# EAGLE design IOIO-v12 (EAGLE 5.11)
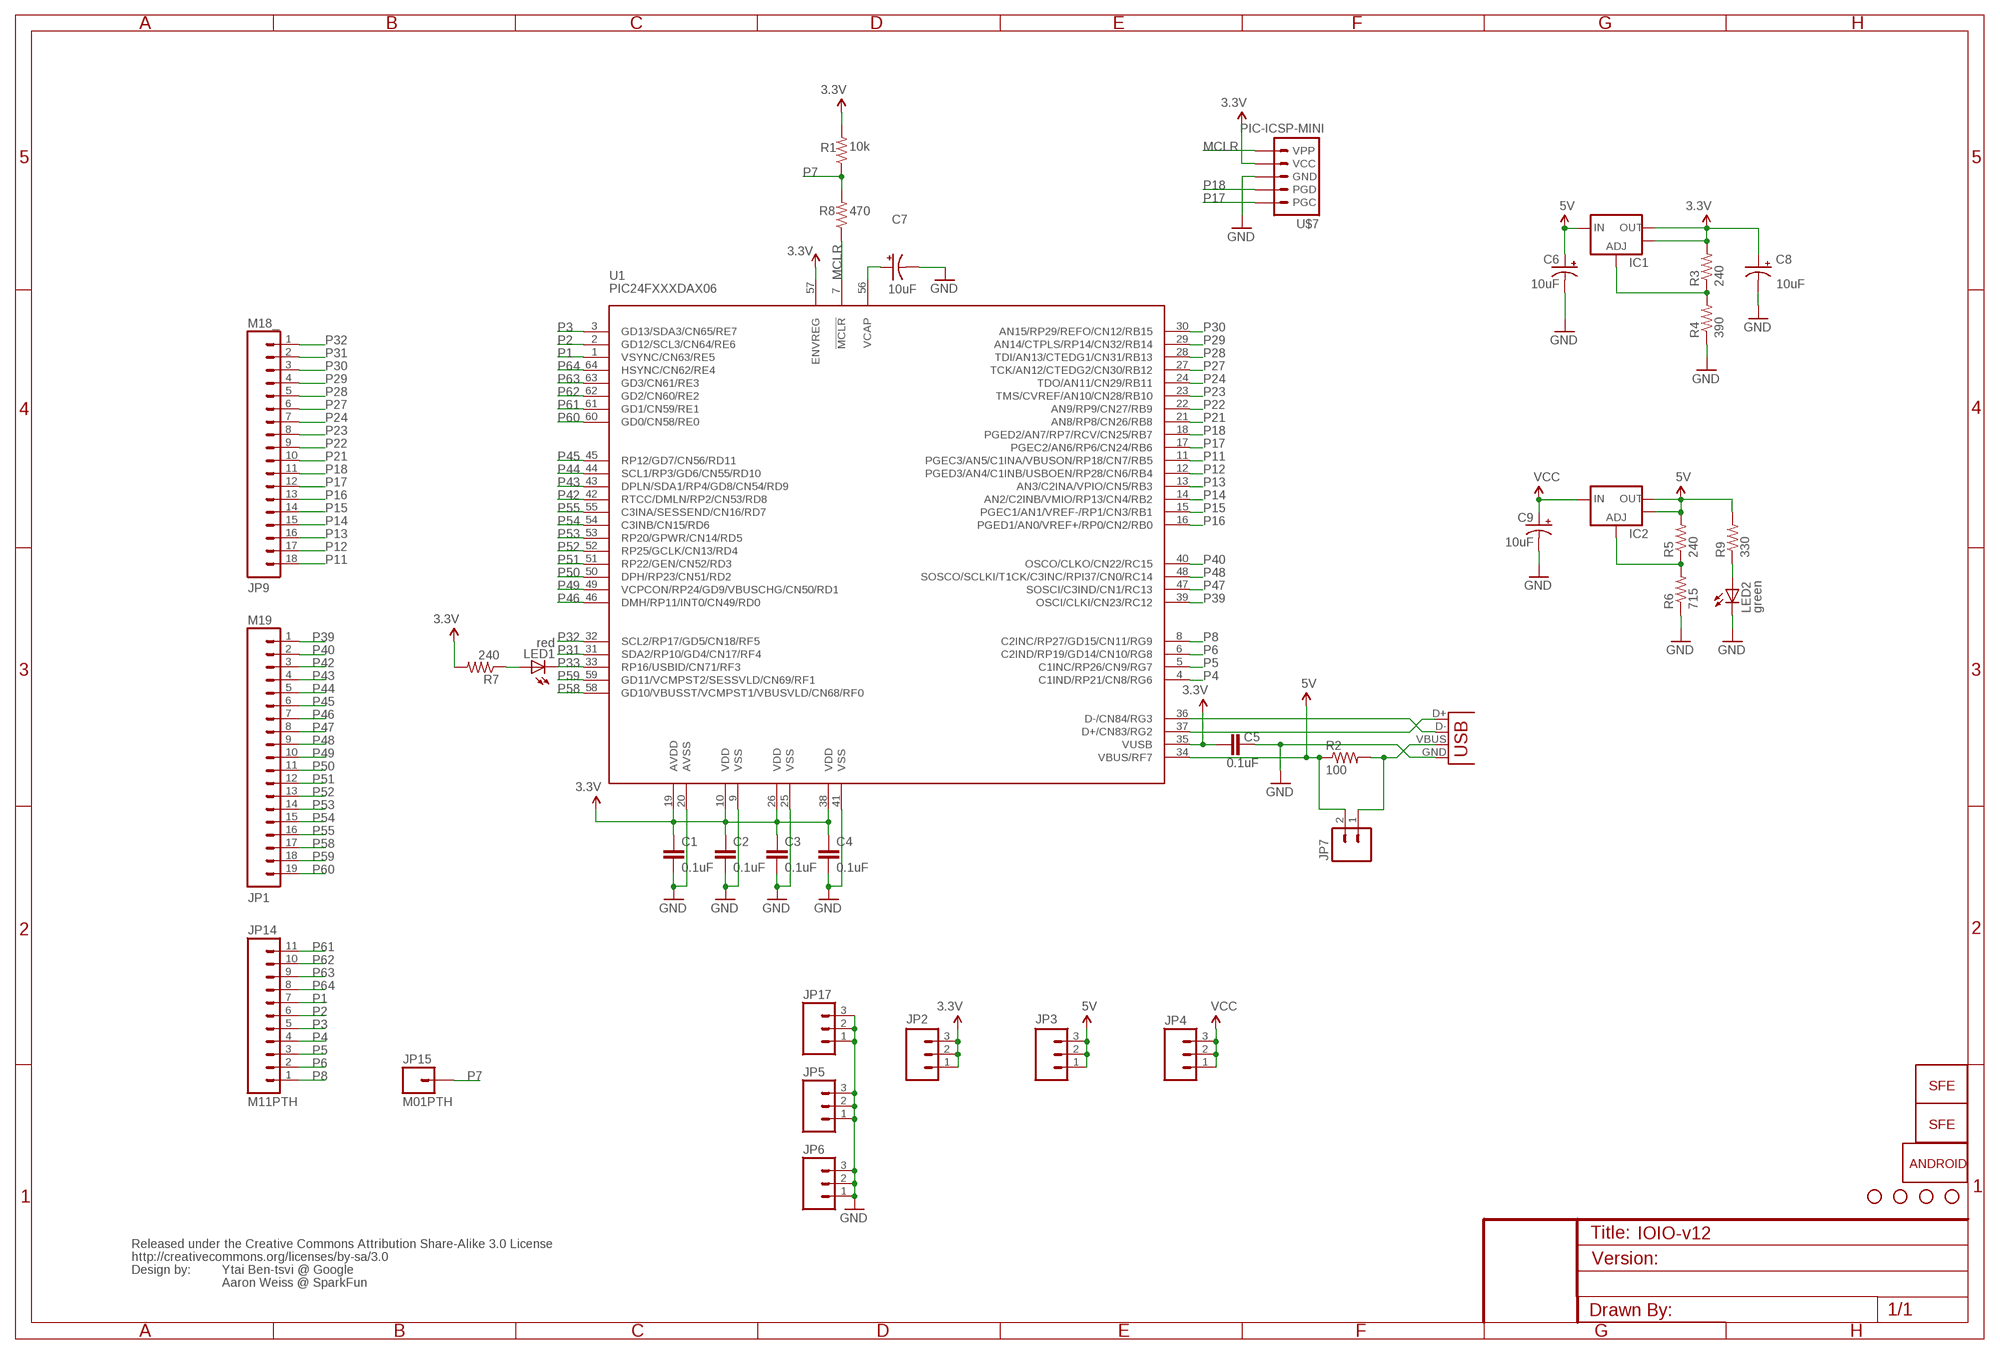
[diagram p0: schematic, sheet 1]

## Parts
C1  0.1uF  CAP0402-CAP  [0402-CAP]
C2  0.1uF  CAP0402-CAP  [0402-CAP]
C3  0.1uF  CAP0402-CAP  [0402-CAP]
C4  0.1uF  CAP0402-CAP  [0402-CAP]
C5  0.1uF  CAP0402-CAP  [0402-CAP]
C6  10uF  CAP_POL1206  [EIA3216]
C7  10uF  CAP_POL1206  [EIA3216]
C8  10uF  CAP_POL1206  [EIA3216]
C9  10uF  CAP_POL1206  [EIA3216]
IC1  V_REG_LM1117SOT223  [SOT223]
IC2  V_REG_LM1117SOT223  [SOT223]
JP1  M19  [1X19]
JP2  M03PTH  [1X03]
JP3  M03PTH  [1X03]
JP4  M03PTH  [1X03]
JP5  M03PTH  [1X03]
JP6  M03PTH  [1X03]
JP7  M02PTH  [1X02]
JP8  LOGO-SFENEW  [SFE-NEW-WEBLOGO]
JP9  M18_  [1X18]
JP10  STAND-OFF  [STAND-OFF]
JP11  STAND-OFF  [STAND-OFF]
JP12  STAND-OFF  [STAND-OFF]
JP13  STAND-OFF  [STAND-OFF]
JP14  M11PTH  [1X11]
JP15  M01PTH  [1X01]
JP16  LOGO-SFESK  [SFE-LOGO-FLAME]
JP17  M03PTH  [1X03]
LED1  red  LED0603  [LED-0603]
LED2  green  LED0603  [LED-0603]
R1  10k  RESISTOR0402-RES  [0402-RES]
R2  100  RESISTOR0402-RES  [0402-RES]
R3  240  RESISTOR0402-RES  [0402-RES]
R4  390  RESISTOR0402-RES  [0402-RES]
R5  240  RESISTOR0402-RES  [0402-RES]
R6  715  RESISTOR0402-RES  [0402-RES]
R7  240  RESISTOR0402-RES  [0402-RES]
R8  470  RESISTOR0402-RES  [0402-RES]
R9  330  RESISTOR0402-RES  [0402-RES]
U1  PIC24FXXXDAX06  [PIC24FXXX_TQFP64]
U$1  CREATIVE_COMMONS  [CREATIVE_COMMONS]
U$6  SPARKFUN_ANDROID-IOIO  [SPARKFUN_ANDROID-IOIO-LARGE]
U$7  PIC-ICSP-MINI  [PIC-ICSP-MINI]
X1  USB-A-SMD  [USB-A-S-NOSILK-FEMALE]

## Nets
3.3V: C1.1 C2.1 C3.1 C4.1 C5.1 C8.A(+) IC1.2(OUT) IC1.4(OUT) JP2.1 JP2.2 JP2.3 R1.2 R3.2 R7.2 U1.10(VDD) U1.19(AVDD) U1.26(VDD) U1.35(VUSB) U1.38(VDD) U1.57(ENVREG) U$7.2(VCC)
5V: C6.A(+) IC1.3(IN) IC2.2(OUT) IC2.4(OUT) JP3.1 JP3.2 JP3.3 JP7.2 R2.1 R5.2 R9.2 U1.34(VBUS/RF7)
GND: C1.2 C2.2 C3.2 C4.2 C5.2 C6.C(-) C7.C(-) C8.C(-) C9.C(-) JP5.1 JP5.2 JP5.3 JP6.1 JP6.2 JP6.3 JP17.1 JP17.2 JP17.3 LED2.C R4.1 R6.1 U1.9(VSS) U1.20(AVSS) U1.25(VSS) U1.41(VSS) U$7.3(GND) X1.GND
MCLR: R8.1 U1.7(!MCLR) U$7.1(VPP)
N$1: IC1.1(ADJ) R3.1 R4.2
N$2: LED1.A R7.1
N$3: LED2.A R9.1
N$4: JP7.1 R2.2 X1.VBUS
N$5: C7.A(+) U1.56(VCAP)
N$6: U1.36(D-/CN84/RG3) X1.D-
N$7: U1.37(D+/CN83/RG2) X1.D+
N$9: IC2.1(ADJ) R5.1 R6.2
P1: JP14.7 U1.1(VSYNC/CN63/RE5)
P2: JP14.6 U1.2(GD12/SCL3/CN64/RE6)
P3: JP14.5 U1.3(GD13/SDA3/CN65/RE7)
P4: JP14.4 U1.4(C1IND/RP21/CN8/RG6)
P5: JP14.3 U1.5(C1INC/RP26/CN9/RG7)
P6: JP14.2 U1.6(C2IND/RP19/GD14/CN10/RG8)
P7: JP15.1 R1.1 R8.2
P8: JP14.1 U1.8(C2INC/RP27/GD15/CN11/RG9)
P11: JP9.18 U1.11(PGEC3/AN5/C1INA/VBUSON/RP18/CN7/RB5)
P12: JP9.17 U1.12(PGED3/AN4/C1INB/USBOEN/RP28/CN6/RB4)
P13: JP9.16 U1.13(AN3/C2INA/VPIO/CN5/RB3)
P14: JP9.15 U1.14(AN2/C2INB/VMIO/RP13/CN4/RB2)
P15: JP9.14 U1.15(PGEC1/AN1/VREF-/RP1/CN3/RB1)
P16: JP9.13 U1.16(PGED1/AN0/VREF+/RP0/CN2/RB0)
P17: JP9.12 U1.17(PGEC2/AN6/RP6/CN24/RB6) U$7.5(PGC)
P18: JP9.11 U1.18(PGED2/AN7/RP7/RCV/CN25/RB7) U$7.4(PGD)
P21: JP9.10 U1.21(AN8/RP8/CN26/RB8)
P22: JP9.9 U1.22(AN9/RP9/CN27/RB9)
P23: JP9.8 U1.23(TMS/CVREF/AN10/CN28/RB10)
P24: JP9.7 U1.24(TDO/AN11/CN29/RB11)
P27: JP9.6 U1.27(TCK/AN12/CTEDG2/CN30/RB12)
P28: JP9.5 U1.28(TDI/AN13/CTEDG1/CN31/RB13)
P29: JP9.4 U1.29(AN14/CTPLS/RP14/CN32/RB14)
P30: JP9.3 U1.30(AN15/RP29/REFO/CN12/RB15)
P31: JP9.2 U1.31(SDA2/RP10/GD4/CN17/RF4)
P32: JP9.1 U1.32(SCL2/RP17/GD5/CN18/RF5)
P33: LED1.C U1.33(RP16/USBID/CN71/RF3)
P39: JP1.1 U1.39(OSCI/CLKI/CN23/RC12)
P40: JP1.2 U1.40(OSCO/CLKO/CN22/RC15)
P42: JP1.3 U1.42(RTCC/DMLN/RP2/CN53/RD8)
P43: JP1.4 U1.43(DPLN/SDA1/RP4/GD8/CN54/RD9)
P44: JP1.5 U1.44(SCL1/RP3/GD6/CN55/RD10)
P45: JP1.6 U1.45(RP12/GD7/CN56/RD11)
P46: JP1.7 U1.46(DMH/RP11/INT0/CN49/RD0)
P47: JP1.8 U1.47(SOSCI/C3IND/CN1/RC13)
P48: JP1.9 U1.48(SOSCO/SCLKI/T1CK/C3INC/RPI37/CN0/RC14)
P49: JP1.10 U1.49(VCPCON/RP24/GD9/VBUSCHG/CN50/RD1)
P50: JP1.11 U1.50(DPH/RP23/CN51/RD2)
P51: JP1.12 U1.51(RP22/GEN/CN52/RD3)
P52: JP1.13 U1.52(RP25/GCLK/CN13/RD4)
P53: JP1.14 U1.53(RP20/GPWR/CN14/RD5)
P54: JP1.15 U1.54(C3INB/CN15/RD6)
P55: JP1.16 U1.55(C3INA/SESSEND/CN16/RD7)
P58: JP1.17 U1.58(GD10/VBUSST/VCMPST1/VBUSVLD/CN68/RF0)
P59: JP1.18 U1.59(GD11/VCMPST2/SESSVLD/CN69/RF1)
P60: JP1.19 U1.60(GD0/CN58/RE0)
P61: JP14.11 U1.61(GD1/CN59/RE1)
P62: JP14.10 U1.62(GD2/CN60/RE2)
P63: JP14.9 U1.63(GD3/CN61/RE3)
P64: JP14.8 U1.64(HSYNC/CN62/RE4)
VCC: C9.A(+) IC2.3(IN) JP4.1 JP4.2 JP4.3

## Notes on the sheet
- Ytai Ben-tsvi @ Google
- Aaron Weiss @ SparkFun

## Library data of the parts
C1-C5 = SparkFun:CAP: Capacitor Standard 0603 ceramic capacitor, and 0.1" leaded capacitor.
C6-C9 = SparkFun:CAP_POL: Capacitor Polarized These are standard SMD and PTH capacitors. Normally 10uF, 47uF, and 100uF in electrolytic and tantalum varieties. Always verify the external diameter of the through hole cap, it varies with capacity, voltage, and manufacturer. The EIA devices should be standard.
IC1 IC2 = SparkFun:V_REG_LM1117: Voltage Regulator LM1117 Standard adjustable voltage regulator but in SMD form. Spark Fun Electronics SKU : COM-00595
JP1 = SparkFun:M19
JP2-JP6 JP17 = SparkFun:M03: Header 3 Standard 3-pin 0.1" header. Use with straight break away headers (SKU : PRT-00116), right angle break away headers (PRT-00553), swiss pins (PRT-00743), machine pins (PRT-00117), and female headers (PRT-00115). Molex polarized connector foot print use with SKU : PRT-08232 with associated crimp pins and housings.
JP7 = SparkFun:M02: Header 2 Standard 2-pin 0.1" header. Use with straight break away headers (SKU : PRT-00116), right angle break away headers (PRT-00553), swiss pins (PRT-00743), machine pins (PRT-00117), and female headers (PRT-00115). Molex polarized connector foot print use with SKU : PRT-08233 with associated crimp pins and housings.
JP8 JP16 = SparkFun:LOGO-SFE: Spark Fun Electronics PCB Logo This is the standard Spark Fun Electronics PCB logo.
JP9 = SparkFun:M18
JP10-JP13 = SparkFun:STAND-OFF: Stand Off This is the mechanical footprint for a #4 phillips button head screw. Use the keepout ring to avoid running the screw head into surrounding components. SKU : PRT-00447
JP14 = SparkFun:M11: Header 11 Standard 11-pin 0.1" header. Use with straight break away headers (SKU : PRT-00116), right angle break away headers (PRT-00553), swiss pins (PRT-00743), machine pins (PRT-00117), and female headers (PRT-00115).
JP15 = SparkFun:M01: Header 1 Standard 1-pin 0.1" header. Use with straight break away headers (SKU : PRT-00116), right angle break away headers (PRT-00553), swiss pins (PRT-00743), machine pins (PRT-00117), and female headers (PRT-00115).
LED1 LED2 = SparkFun:LED: LEDs Standard schematic elements and footprints for 5mm, 3mm, 1206, and 0603 sized LEDs. 5mm - Spark Fun Electronics SKU : COM-00529 (and others)
R1-R9 = SparkFun:RESISTOR: Resistor Basic schematic elements and footprints for 0603, 1206, and PTH resistors.
U1 = SparkFun:PIC24FXXXDAX06: PIC24FXXXDAX06 PIC24FXXXDA106 / PIC24FXXXDA206
U$1 = SparkFun:CREATIVE_COMMONS
U$6 = IOIO-v12:SPARKFUN_ANDROID-IOIO
U$7 = SparkFun:PIC-ICSP-MINI: PIC-ICSP-Mini Miniature 5-pin connection for temporary programming of PICs. Use this device in your design to save space. Program the PIC with this adapter Spark Fun Electronics SKU : BOB-00194
X1 = SparkFun:USB: USB Connectors USB-B-PTH is fully proven SKU : PRT-00139 USB-miniB is fully proven SKU : PRT-00587 USB-A-PCB is untested. USB-A-H is throughly reviewed, but untested. Spark Fun Electronics SKU : PRT-00437 USB-B-SMT is throughly reviewed, but untested. Needs silkscreen touching up. USB-A-S has not been used/tested USB-MB-H has not been used/tested

## Board
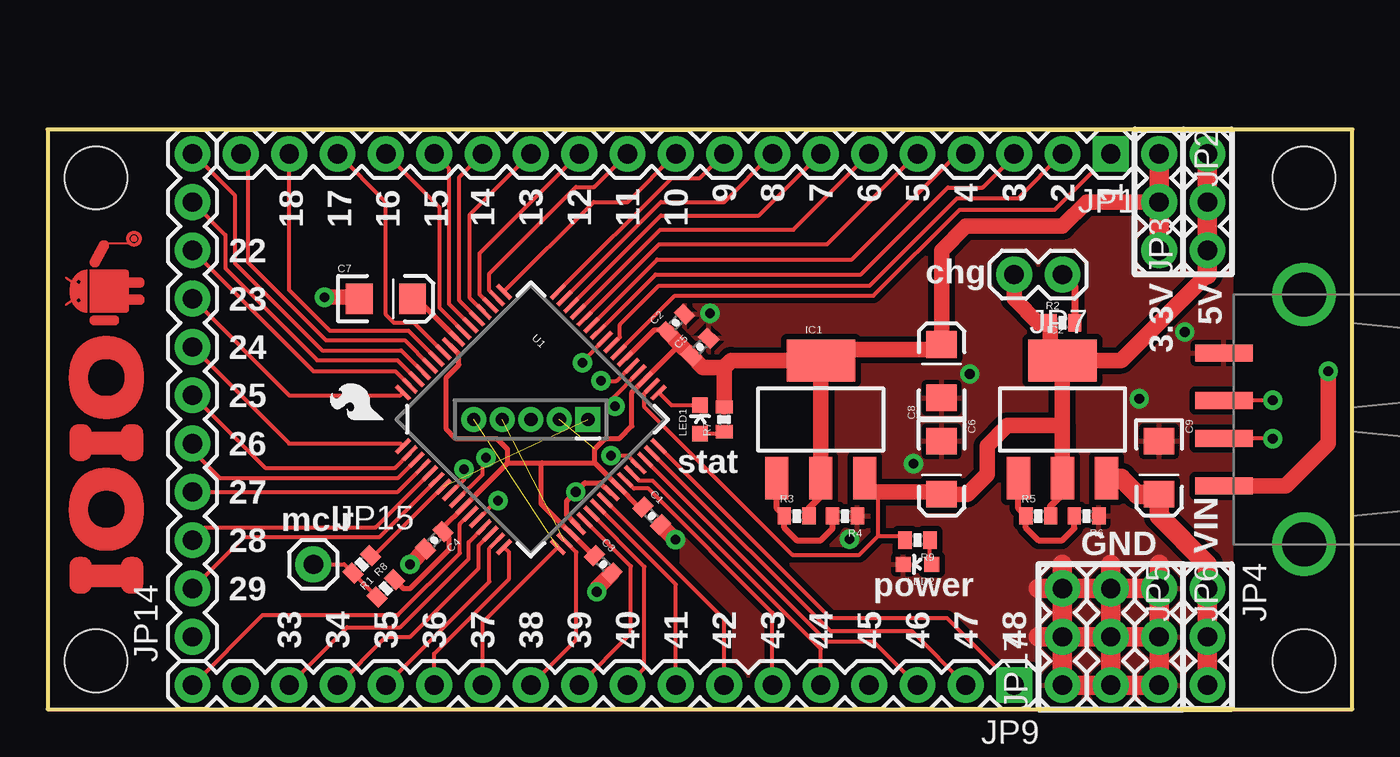
[diagram p1: board, top side]
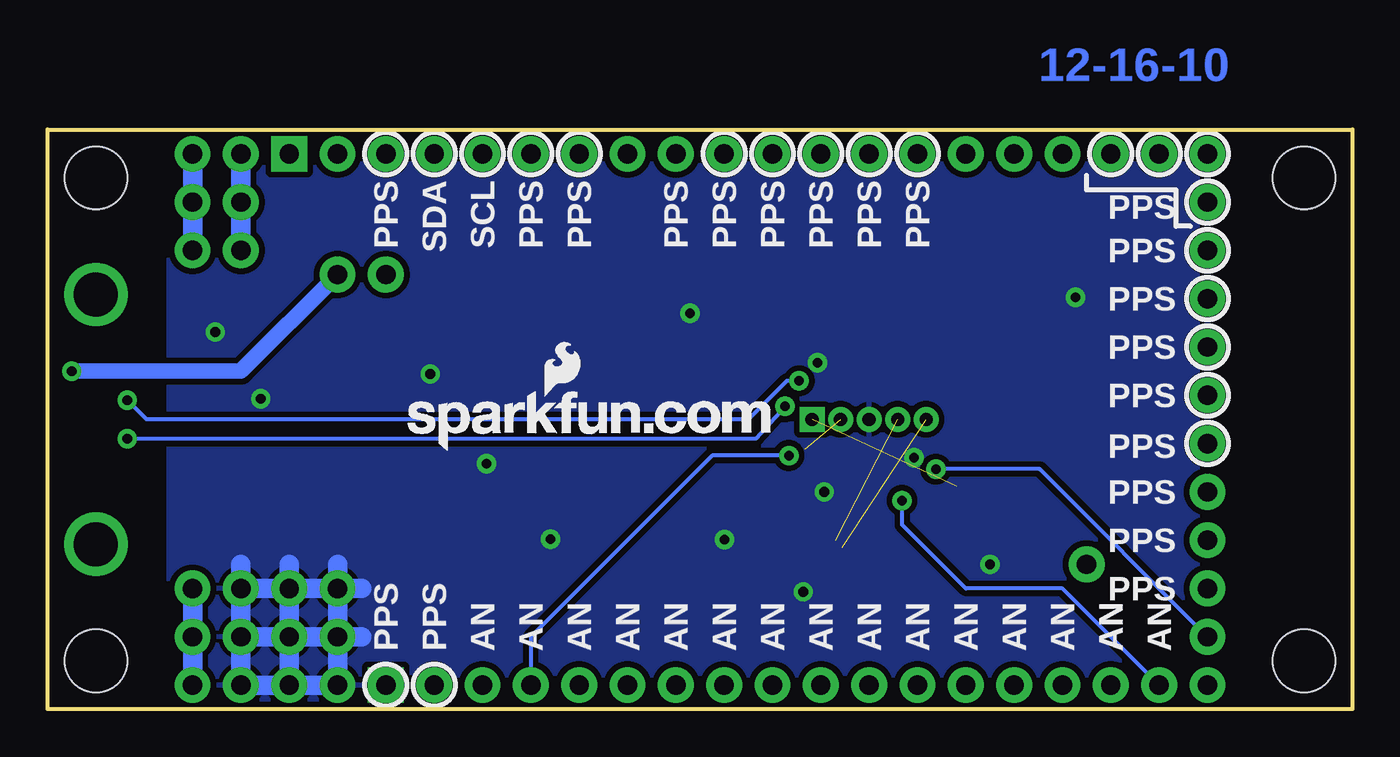
[diagram p2: board, bottom side, seen from below]

Size 68.58 x 30.48 mm. Coordinates in mm from the lower left corner, seen from the top.
Outline: 0,0 68.58,0 68.58,30.48 0,30.48 0,0
Copper layers (1*16): Top 0.035mm / dielectric 1.5mm / Bottom 0.035mm
Design rules "SparkFun": minimum track width 8mil, minimum drill 20mil, track to track 8mil, track to pad 8mil, pad to pad 8mil, via to via 8mil, smd to smd 8mil, copper to edge 8mil, drill to drill 8mil, minimum pad ring 12mil, minimum via ring 10mil, stop-mask expansion 4mil, vias tented up to drill 20mil, thermal gap 10mil

### Footprints (pad centres in the part's own frame; a part is rotated, then mirrored left to right if it is on the bottom)
0402-CAP = smd 0.7 x 0.9: 1 -0.65,0; 2 0.65,0
EIA3216 = smd 1.4 x 1.6: A 1.4,0; C -1.4,0
SOT223 = smd 1.219 x 2.235: 1 -2.311,-3.099; 2 0,-3.099; 3 2.311,-3.099 | smd 3.6 x 2.2: 4 0,3.099
1X19 = drill 1.016 pad 1.88 square: 1 0,0 | drill 1.016 pad 1.88 round: 2 2.54,0; 3 5.08,0; 4 7.62,0; 5 10.16,0; 6 12.7,0; 7 15.24,0; 8 17.78,0; 9 20.32,0; 10 22.86,0; 11 25.4,0; 12 27.94,0; 13 30.48,0; 14 33.02,0; 15 35.56,0; 16 38.1,0; 17 40.64,0; 18 43.18,0; 19 45.72,0
1X03 = drill 1.016 pad 1.88 round: 1 0,0; 2 2.54,0; 3 5.08,0
1X02 = drill 1.016 pad 1.88 round: 1 0,0; 2 2.54,0
1X18 = drill 1.016 pad 1.88 square: 1 0,0 | drill 1.016 pad 1.88 round: 2 2.54,0; 3 5.08,0; 4 7.62,0; 5 10.16,0; 6 12.7,0; 7 15.24,0; 8 17.78,0; 9 20.32,0; 10 22.86,0; 11 25.4,0; 12 27.94,0; 13 30.48,0; 14 33.02,0; 15 35.56,0; 16 38.1,0; 17 40.64,0; 18 43.18,0
STAND-OFF = hole 3.302: 0,0
1X11 = drill 1.016 pad 1.88 round: 1 0,0; 2 2.54,0; 3 5.08,0; 4 7.62,0; 5 10.16,0; 6 12.7,0; 7 15.24,0; 8 17.78,0; 9 20.32,0; 10 22.86,0; 11 25.4,0
1X01 = drill 1.016 pad 1.88 round: 1 0,0
LED-0603 = smd 0.8 x 0.8: A 0,-0.75; C 0,0.75
0402-RES = smd 0.7 x 0.9: 1 -0.65,0; 2 0.65,0
PIC24FXXX_TQFP64 = smd 0.22 x 1: 1 -3.75,-5.75; 2 -3.25,-5.75; 3 -2.75,-5.75; 4 -2.25,-5.75; 5 -1.75,-5.75; 6 -1.25,-5.75; 7 -0.75,-5.75; 8 -0.25,-5.75; 9 0.25,-5.75; 10 0.75,-5.75; 11 1.25,-5.75; 12 1.75,-5.75; 13 2.25,-5.75; 14 2.75,-5.75; 15 3.25,-5.75; 16 3.75,-5.75; 33 3.75,5.75; 34 3.25,5.75; 35 2.75,5.75; 36 2.25,5.75; 37 1.75,5.75; 38 1.25,5.75; 39 0.75,5.75; 40 0.25,5.75; 41 -0.25,5.75; 42 -0.75,5.75; 43 -1.25,5.75; 44 -1.75,5.75; 45 -2.25,5.75; 46 -2.75,5.75; 47 -3.25,5.75; 48 -3.75,5.75 | smd 1 x 0.22: 17 5.75,-3.75; 18 5.75,-3.25; 19 5.75,-2.75; 20 5.75,-2.25; 21 5.75,-1.75; 22 5.75,-1.25; 23 5.75,-0.75; 24 5.75,-0.25; 25 5.75,0.25; 26 5.75,0.75; 27 5.75,1.25; 28 5.75,1.75; 29 5.75,2.25; 30 5.75,2.75; 31 5.75,3.25; 32 5.75,3.75; 49 -5.75,3.75; 50 -5.75,3.25; 51 -5.75,2.75; 52 -5.75,2.25; 53 -5.75,1.75; 54 -5.75,1.25; 55 -5.75,0.75; 56 -5.75,0.25; 57 -5.75,-0.25; 58 -5.75,-0.75; 59 -5.75,-1.25; 60 -5.75,-1.75; 61 -5.75,-2.25; 62 -5.75,-2.75; 63 -5.75,-3.25; 64 -5.75,-3.75
PIC-ICSP-MINI = drill 0.7 square: 1 -3,0 | drill 0.7 round: 2 -1.5,0; 3 0,0; 4 1.5,0; 5 3,0
USB-A-S-NOSILK-FEMALE = smd 3 x 0.9: D+ 4.212,-1; D- 4.212,1; GND 4.212,-3.5; VBUS 4.212,3.5 | drill 2.311 round: P$5 0,-6.566; P$6 0,6.566

### Placement (x,y rotation side)
C1  31.75,10.16 315 top
C2  33.02,20.32 45 top
C3  29.21,7.62 315 top
C4  20.32,8.89 225 top
C5  34.29,19.05 45 top
C6  46.99,12.7 270 top
C7  17.78,21.59 0 top
C8  46.99,17.78 90 top
C9  58.42,12.7 270 top
IC1  40.64,15.24 0 top
IC2  53.34,15.24 0 top
JP1  55.88,29.21 180 top
JP2  58.42,29.21 270 top
JP3  60.96,24.13 90 top
JP4  60.96,6.35 270 top
JP5  55.88,6.35 270 top
JP6  58.42,6.35 270 top
JP7  53.34,22.86 180 top
JP8  49.66,13.59 0 bottom
JP9  50.8,1.27 180 top
JP10  66.04,27.94 0 top
JP11  66.04,2.54 0 top
JP12  2.54,27.94 0 top
JP13  2.54,2.54 0 top
JP14  7.62,3.81 90 top
JP15  13.97,7.62 0 top
JP16  17.65,15.24 90 top
JP17  53.34,1.27 90 top
LED1  34.29,15.24 0 top
LED2  45.72,7.62 90 top
R1  17.78,6.35 45 top
R2  53.34,20.32 0 top
R3  39.37,10.16 0 top
R4  41.91,10.16 180 top
R5  52.07,10.16 0 top
R6  54.61,10.16 180 top
R7  35.56,15.24 90 top
R8  16.51,7.62 225 top
R9  45.72,8.89 180 top
U1  25.4,15.24 315 top
U$1  15.24,-11.43 0 top  (outside the outline)
U$6  5.08,6.1 90 top
U$7  25.4,15.24 180 top
X1  66.04,15.24 180 top

### Tracks (layer width: path | path; a pad name or v marks a point on that pad's centre or on a via)
3.3V  (1 unrouted)
  Top 0.254: U1.38 31.88,19.94 32.48,19.94 C2.1 | U1.35 | U1.35 33.23,19.19 | 28.75,12.95 30,11.71 U1.26 31.08,10.62 C1.1 | U1.35 30.71,16.66 30.71,14.88 30.07,14.25 29.31,14.25 28.75,13.69 28.75,12.95 | 24.18,12.95 25.98,12.95 | 25.98,12.95 28.75,12.95 | 24.18,12.95 U1.10 20.78,9.55 C4.1 21.11,9.02 21.11,8.41 19.05,6.35 18.7,6.35 R1.2 | 25.98,12.95 25.93,12.9 25.93,10.82 28.67,8.08 C3.1 28.67,8.08 U1.19 | 24.18,12.95 24.18,13.66 23.62,14.22 21.46,14.22 20.95,14.73 20.95,17.45 21.61,18.11 21.61,18.67 U1.57
  Top 0.381: IC1.2 40.64,11.2 40.02,10.58 R3.2
  Top 0.813: 35.56,17.98 R7.2 | 35.56,17.98 35.92,18.34 IC1.4 | C2.1 33.23,19.19 C5.1 34.44,17.98 35.56,17.98 | JP2.2 54.61,26.67 53.34,25.4 48.26,25.4 46.99,24.13 C8.A 46.99,18.92 41.22,18.92 IC1.4 | IC1.4 IC1.2
  Top 1.016: JP2.1 JP2.2 JP2.3
  Bottom 1.016: JP2.1 JP2.3
5V
  Top 0.203: 43.66,9.12 42.67,8.13 39.14,8.13 31.34,15.93 31.34,16.59 U1.34 | 43.66,9.12 43.66,11.43 IC1.3 | 43.66,9.12 44.84,9.12 R9.2
  Top 0.381: R5.2 52.72,10.68 53.37,11.33 53.37,12.12 IC2.2
  Top 0.813: IC2.4 56.44,18.34 60.96,22.86 | IC2.4 52.69,18.99 R2.1 52.07,20.32 50.8,21.59 JP7.2 | 53.34,14.86 IC2.2 | 53.34,14.86 IC2.4 | 43.66,11.43 46.86,11.43 C6.A 48.33,11.3 49.38,12.34 49.38,13.84 50.44,14.91 53.29,14.91 53.34,14.86
  Top 1.016: JP3.3 JP3.1 60.96,22.86
  Bottom 1.016: JP3.3 JP3.2 JP3.1
GND  (via drill 0.51)
  Top 0.203: U1.9 22.86,12.34 22.86,12.9 v23.04,13.23 | U1.41 29.29,19.46 28.12,18.29 v28.12,18.21
  Top 0.254: U1.20 27.91,9.58 27.28,10.21 27.28,10.95 v27.76,11.43 28.25,11.91 29.06,11.91 29.62,11.35 U1.25
  Top 0.813: C1.2 32.99,8.91 v33.01,8.91 | C3.2 28.87,6.36 v28.87,6.17 | C4.2 v19.05,7.62 | C7.C 16.3,21.67 v14.55,21.67
  Top 1.016: JP5.3 55.88,7.62 | JP5.3 JP6.3 JP6.2 | JP6.2 JP6.1 | JP6.1 58.42,7.62 | JP6.1 52.07,6.35 | JP6.2 52.07,3.81 | 53.34,7.62 JP17.1 JP5.3
  Bottom 1.016: JP5.3 55.88,7.62 | JP5.3 JP6.3 JP6.2 | JP6.2 JP6.1 | JP6.1 58.42,7.62 | JP6.1 52.07,6.35 | JP6.2 52.07,3.81 | 53.34,7.62 JP17.1 JP5.3
  other vias: 42.14,8.94 45.52,12.9 48.46,17.63 57.38,16.33 34.82,20.83 59.77,19.84
  pour Bottom (isolate 0.305): 6.35,30.48 62.23,30.48 62.23,0 6.35,0
  pour Top (isolate 0.305): 33.3,30.35 33.3,-0.13 62.23,0 62.23,30.48
MCLR  (1 unrouted)
  Top 0.203: U1.7 17.18,8.08 R8.1
N$1
  Top 0.305: IC1.1 38.33,10.55 R3.1 38.72,9.54 39.37,8.89 40.64,8.89 41.26,9.51 R4.2
N$2
  Top 0.203: LED1.A 35.46,14.49 R7.1
N$3
  Top 0.203: R9.1 46.37,7.72 LED2.A
N$4  (via drill 0.51)
  Top 0.381: R2.2 53.99,22.21 JP7.1
  Top 0.813: X1.VBUS 65.08,11.74 67.31,13.97 v67.31,17.78
  Bottom 0.813: v67.31,17.78 58.42,17.78 JP7.1
N$5
  Top 0.254: U1.56 19.41,21.59 C7.A
N$6  (via drill 0.51)
  Top 0.203: X1.D- 64.37,14.24 v64.39,14.22 | v29.82,15.93 29.72,16.38 U1.36
  Bottom 0.203: v64.39,14.22 31.37,14.22 v29.82,15.93
N$7  (via drill 0.51)
  Top 0.203: X1.D+ 64.37,16.24 v64.39,16.26 | v29.08,17.27 29.91,17.27 U1.37
  Bottom 0.203: v64.39,16.26 63.37,15.24 31.75,15.24 29.72,17.27 v29.08,17.27
N$9
  Top 0.305: IC2.1 51.03,10.55 R5.1 51.42,9.54 52.07,8.89 53.34,8.89 53.96,9.51 R6.2
P1
  Top 0.203: U1.1 18.54,13.97 12.7,13.97 JP14.7
P2
  Top 0.203: U1.2 18.26,12.7 11.43,12.7 JP14.6
P3
  Top 0.203: U1.3 18.44,12.17 9.04,12.17 7.62,13.59 JP14.5
P4
  Top 0.203: U1.4 18.41,11.43 JP14.4
P5
  Top 0.203: U1.5 17.25,9.56 17.25,9.55 8.28,9.55 JP14.3
P6
  Top 0.203: U1.6 17.46,9.07 10.34,9.07 JP14.2
P7
  Top 0.203: R1.1 R8.2 15.59,7.62 JP15.1
P8  (via drill 0.51)
  Top 0.203: U1.8 21.89,12.09 v21.89,12.62
  Bottom 0.203: v21.89,12.62 16.43,12.62 JP14.1
P11
  Top 0.203: U1.11 21.67,9.74 21.67,8.2 18.41,4.95 11.3,4.95 JP9.18
P12  (via drill 0.51)
  Top 0.203: U1.12 23.61,10.97 v23.67,10.97
  Bottom 0.203: v23.67,10.97 23.67,9.7 20.32,6.35 15.24,6.35 JP9.17
P13
  Top 0.203: U1.13 22.12,8.78 22.12,7.9 18.54,4.32 15.75,4.32 JP9.16
P14
  Top 0.203: U1.14 22.66,8.61 22.66,7.42 19.05,3.81 17.78,3.81 JP9.15
P15
  Top 0.203: U1.15 23.22,8.46 23.22,6.71 JP9.14
P16
  Top 0.203: JP9.13 20.32,2.92 24.26,6.86 24.26,8.25 U1.16
P17  (1 unrouted)
  Top 0.203: JP9.12 22.86,4.57 U1.17
P18  (1 unrouted)
  Top 0.203: U1.18 27.79,8.26 27.79,3.66 JP9.11
P21
  Top 0.203: U1.21 30.66,7.52 30.66,3.99 JP9.10
P22
  Top 0.203: U1.22 28.6,10.29 28.6,10.27 31.37,7.49 31.37,2.16 JP9.9
P23
  Top 0.203: U1.23 33.02,6.56 JP9.8
P24
  Top 0.203: U1.24 35.56,4.73 JP9.7
P27
  Top 0.203: U1.27 30.81,11.61 31.57,11.61 38.1,5.08 JP9.6
P28
  Top 0.203: U1.28 30.72,12.41 30.72,12.39 31.09,12.01 31.8,12.01 40.64,3.17 JP9.5
P29  (via drill 0.51)
  Top 0.203: 31.07,12.77 U1.29 30.49,13.34 v29.62,13.34
  Bottom 0.203: v29.62,13.34 33.66,13.34 43.18,3.81 JP9.4
P30
  Top 0.203: U1.30 40.95,3.58 43.41,3.58 JP9.3
P31
  Top 0.203: U1.31 32.56,12.68 41.15,4.12 45.41,4.12 JP9.2
P32
  Top 0.203: U1.32 41.14,4.8 47.27,4.8 JP9.1
P33
  Top 0.203: LED1.C 32.78,15.99 U1.33
P39
  Top 0.203: U1.39 32.96,21.74 43.41,21.74 47.93,26.26 52.93,26.26 JP1.1
P40
  Top 0.203: U1.40 30.07,19.56 30.07,20.22 32.13,22.28 43.2,22.28 47.8,26.87 51,26.87 JP1.2
P42
  Top 0.203: U1.42 31.96,22.86 42.75,22.86 47.32,27.43 49.15,27.43 50.8,29.08 JP1.3
P43
  Top 0.203: U1.43 32.04,23.65 42.27,23.65 47.83,29.21 JP1.4
P44
  Top 0.203: U1.44 32.15,24.46 40.97,24.46 JP1.5
P45
  Top 0.203: U1.45 32.2,25.22 39.19,25.22 JP1.6
P46
  Top 0.203: U1.46 32.23,25.96 37.39,25.96 JP1.7
P47
  Top 0.203: U1.47 32.23,26.67 35.56,26.67 JP1.8
P48
  Top 0.203: U1.48 32.8,27.94 34.29,27.94 JP1.9
P49
  Top 0.203: U1.49 28.7,26.67 30.48,26.67 JP1.10
P50
  Top 0.203: U1.50 23.22,22.02 23.22,22.91 27.76,27.46 28.73,27.46 JP1.11
P51
  Top 0.203: U1.51 22.71,21.82 22.71,23.98 JP1.12
P52
  Top 0.203: U1.52 22.92,20.9 22.2,21.61 22.2,26.01 JP1.13
P53
  Top 0.203: U1.53 22.57,20.56 21.64,21.49 21.64,27.99 JP1.14
P54
  Top 0.203: U1.54 21.11,21.31 21.11,28.42 JP1.15
P55
  Top 0.203: U1.55 20.6,21.11 20.6,26.39 JP1.16
P58
  Top 0.203: U1.58 19.26,20.32 18.21,20.32 17.78,20.75 17.78,26.67 JP1.17
P59
  Top 0.203: U1.59 18.96,19.91 14.83,19.91 12.7,22.05 JP1.18
P60
  Top 0.203: U1.60 18.76,19.41 14.63,19.41 10.54,23.5 10.54,28.83 JP1.19
P61
  Top 0.203: U1.61 18.59,18.87 14.43,18.87 9.86,23.44 9.86,27 7.64,29.21 JP14.11
P62
  Top 0.203: U1.62 18.39,18.36 14.17,18.36 9.35,23.19 9.35,24.94 JP14.10
P63
  Top 0.203: U1.63 18.26,17.78 13.97,17.78 JP14.9
P64
  Top 0.203: U1.64 18.54,16.51 12.7,16.51 JP14.8
VCC
  Top 1.016: JP4.3 JP4.2 JP4.1 60.96,7.62 58.42,10.16 C9.A 57.28,11.3 56.44,12.14 IC2.3
  Bottom 1.016: JP4.3 JP4.1

### Text on the board
Bottom: 12-16-10
tPlace: 9 | 8 | 7 | 6 | 5 | 4 | 3 | 2 | 1 | 18 | 17 | 16 | 15 | 14 | 13 | 12 | 11 | 10 | chg | 22 | 3.3V | 5V | 23 | 24 | 25 | 26 | stat | 27 | mclr | 28 | GND | VIN | 29 | power | 33 | 34 | 35 | 36 | 37 | 38 | 39 | 40 | 41 | 42 | 43 | 44 | 45 | 46 | 47 | 48
bPlace: PPS | PPS | PPS | PPS | PPS | PPS | PPS | PPS | SCL | SDA | PPS | PPS | PPS | PPS | PPS | PPS | PPS | PPS | PPS | PPS | AN | AN | AN | AN | AN | AN | AN | AN | AN | AN | AN | AN | AN | AN | AN | AN | PPS | PPS